# Altium schematic sheet 02.MCU_POWER.SchDoc
size 297 x 209 mm
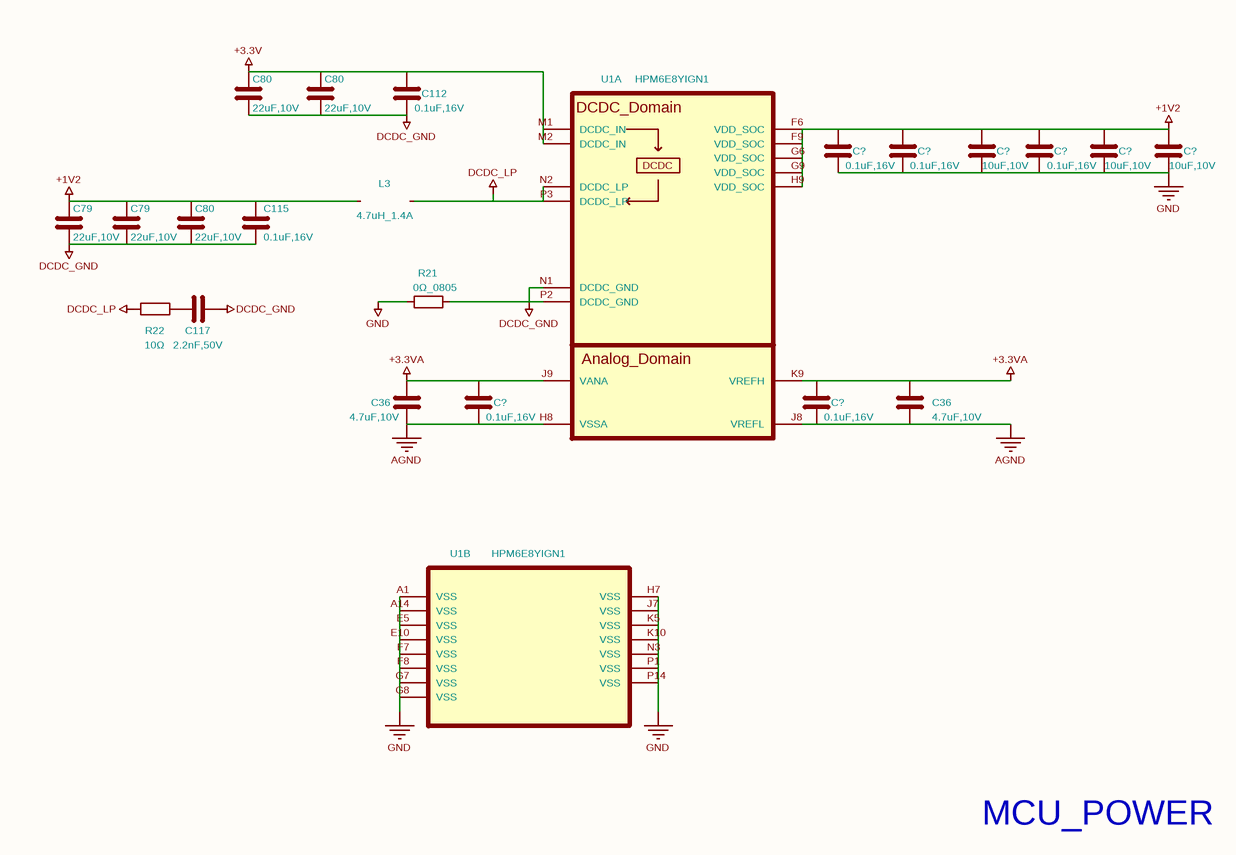
[diagram p0: 02.MCU_POWER.SchDoc]

## Parts
(Parts that share a designator on the sheet are numbered #1, #2 ... from top to bottom, then left to right.)
C36#1  4.7uF,10V  [C_0402]
C36#2  4.7uF,10V  [C_0402]
C79#1  22uF,10V  [C_0603_1608Metric]
C79#2  22uF,10V  [C_0603_1608Metric]
C80#1  22uF,10V  [C_0603_1608Metric]
C80#2  22uF,10V  [C_0603_1608Metric]
C80#3  22uF,10V  [C_0603_1608Metric]
C112  0.1uF,16V  [C_0402]
C115  0.1uF,16V  [C_0402]
C117  2.2nF,50V  [C_0402_1005Metric]
C?#1  0.1uF,16V  [C_0402]
C?#2  0.1uF,16V  [C_0402]
C?#3  10uF,10V  [C_0402]
C?#4  0.1uF,16V  [C_0402]
C?#5  10uF,10V  [C_0402]
C?#6  10uF,10V  [C_0402]
C?#7  0.1uF,16V  [C_0402]
C?#8  0.1uF,16V  [C_0402]
L3  4.7uH_1.4A  [L252010]
R21  0Ω_0805  [R_0805_2012Metric]
R22  10Ω  [R_0402_1005Metric]
U1  HPM6E8YIGN1  [BGA-196_14x14_12.0x12.0mm_P0.8mm]  (parts A,B of 10)

## Nets
+1V2: C79#1.1 C79#2.1 C80#3.1 C115.1 C?#1.1 C?#2.1 C?#3.1 C?#4.1 C?#5.1 C?#6.1 L3.1 U1.F6(VDD_SOC) U1.F9(VDD_SOC) U1.G6(VDD_SOC) U1.G9(VDD_SOC) U1.H9(VDD_SOC)
+3.3V: C80#1.1 C80#2.1 C112.1 U1.M1(DCDC_IN) U1.M2(DCDC_IN)
+3.3VA: C36#1.1 C36#2.1 C?#7.1 C?#8.1 U1.J9(VANA) U1.K9(VREFH)
AGND: C36#1.2 C36#2.2 C?#7.2 C?#8.2 U1.H8(VSSA) U1.J8(VREFL)
DCDC_GND: C79#1.2 C79#2.2 C80#1.2 C80#2.2 C80#3.2 C112.2 C115.2 C117.2 R21.2 U1.N1(DCDC_GND) U1.P2(DCDC_GND)
DCDC_LP: L3.2 R22.1 U1.N2(DCDC_LP) U1.P3(DCDC_LP)
GND: C?#1.2 C?#2.2 C?#3.2 C?#4.2 C?#5.2 C?#6.2 R21.1 U1.A1(VSS) U1.A14(VSS) U1.E5(VSS) U1.E10(VSS) U1.F7(VSS) U1.F8(VSS) U1.G7(VSS) U1.G8(VSS) U1.H7(VSS) U1.J7(VSS) U1.K5(VSS) U1.K10(VSS) U1.N3(VSS) U1.P1(VSS) U1.P14(VSS)
NetC117_1: C117.1 R22.2

## Notes on the sheet
- MCU_POWER
- 1
- 2
- 3
- 4
- 5
- 6
- A
- B
- C
- D
- Title: HPM6E8Y_RbMotor_ECAT
- File: 02.MCU_POWER.kicad_sch
- Sheet: /
- KiCad E.D.A.  kicad (5.1.4)-1
- Size: A4
- Date: 2023-12-28
- Rev: RevB+
- Id: 1/1
- (in symbol HPM6E8YIGN1, part A) DCDC_Domain; DCDC; Analog_Domain

## Library data of the parts
C36#1 C36#2 = 4.7uF,10V_0402: Model: CL05A475MP5NRNC; Company: SAMSUNG(三星); Value: 4.7uF,10V; Footprint: 03_HPM_Capacitance:C_0402
C79#1 C79#2 C80#1-C80#3 = 22uF,10V_0603: Model: CL10A226MP8NUNE; Company: SAMSUNG(三星); Value: 22uF,10V; Footprint: 03_HPM_Capacitance:C_0603_1608Metric
C112 = 0.1uF,16V_0402_6: Model: CL05B104KO5NNNC; Company: SAMSUNG(三星); Value: 0.1uF,16V; Footprint: 03_HPM_Capacitance:C_0402
C115 = 0.1uF,16V_0402_8: Model: CL05B104KO5NNNC; Company: SAMSUNG(三星); Value: 0.1uF,16V; Footprint: 03_HPM_Capacitance:C_0402
C117 = 2.2nF,50V_0402: Model: CL05B222KB5NNNC; Company: SAMSUNG(三星); Value: 2.2nF,50V; Footprint: 03_HPM_Capacitance:C_0402_1005Metric
C?#1 = 0.1uF,16V_0402_7: Model: CL05B104KO5NNNC; Company: SAMSUNG(三星); Value: 0.1uF,16V; Footprint: 03_HPM_Capacitance:C_0402
C?#2 = 0.1uF,16V_0402_17: Model: CL05B104KO5NNNC; Company: SAMSUNG(三星); Value: 0.1uF,16V; Footprint: 03_HPM_Capacitance:C_0402
C?#3 C?#5 C?#6 = 10uF,10V_0402: Model: CL05A106MP5NUNC; Company: SAMSUNG(三星); Value: 10uF,10V; Footprint: 03_HPM_Capacitance:C_0402
C?#4 = 0.1uF,16V_0402_5: Model: CL05B104KO5NNNC; Company: SAMSUNG(三星); Value: 0.1uF,16V; Footprint: 03_HPM_Capacitance:C_0402
C?#7 = 0.1uF,16V_0402_3: Model: CL05B104KO5NNNC; Company: SAMSUNG(三星); Value: 0.1uF,16V; Footprint: 03_HPM_Capacitance:C_0402
C?#8 = 0.1uF,16V_0402_1: Model: CL05B104KO5NNNC; Company: SAMSUNG(三星); Value: 0.1uF,16V; Footprint: 03_HPM_Capacitance:C_0402
L3 = 4.7uH_1.4A: Model: DFE252010F-4R7M; Company: muRata(村田); Value: 4.7uH_1.4A; Footprint: 07_HPM_Inductance:L252010
R21 = 0Ω_0805: Model: RS-05000JT; Company: FH(风华); Value: 0Ω_0805; Footprint: 02_HPM_Resistor:R_0805_2012Metric
R22 = 10Ω_0402: Model: 0402WGF100JTCE; Company: UNI-ROYAL(厚声); Value: 10Ω; Footprint: 02_HPM_Resistor:R_0402_1005Metric
U1 = HPM6E8YIGN1: Value: HPM6E8YIGN1; Footprint: 00_HPM_Library:BGA-196_14x14_12.0x12.0mm_P0.8mm